# Altium schematic sheet Shels_System_Bmduino.SchDoc
size A4; SheetNumber: 1; SheetTotal: 1
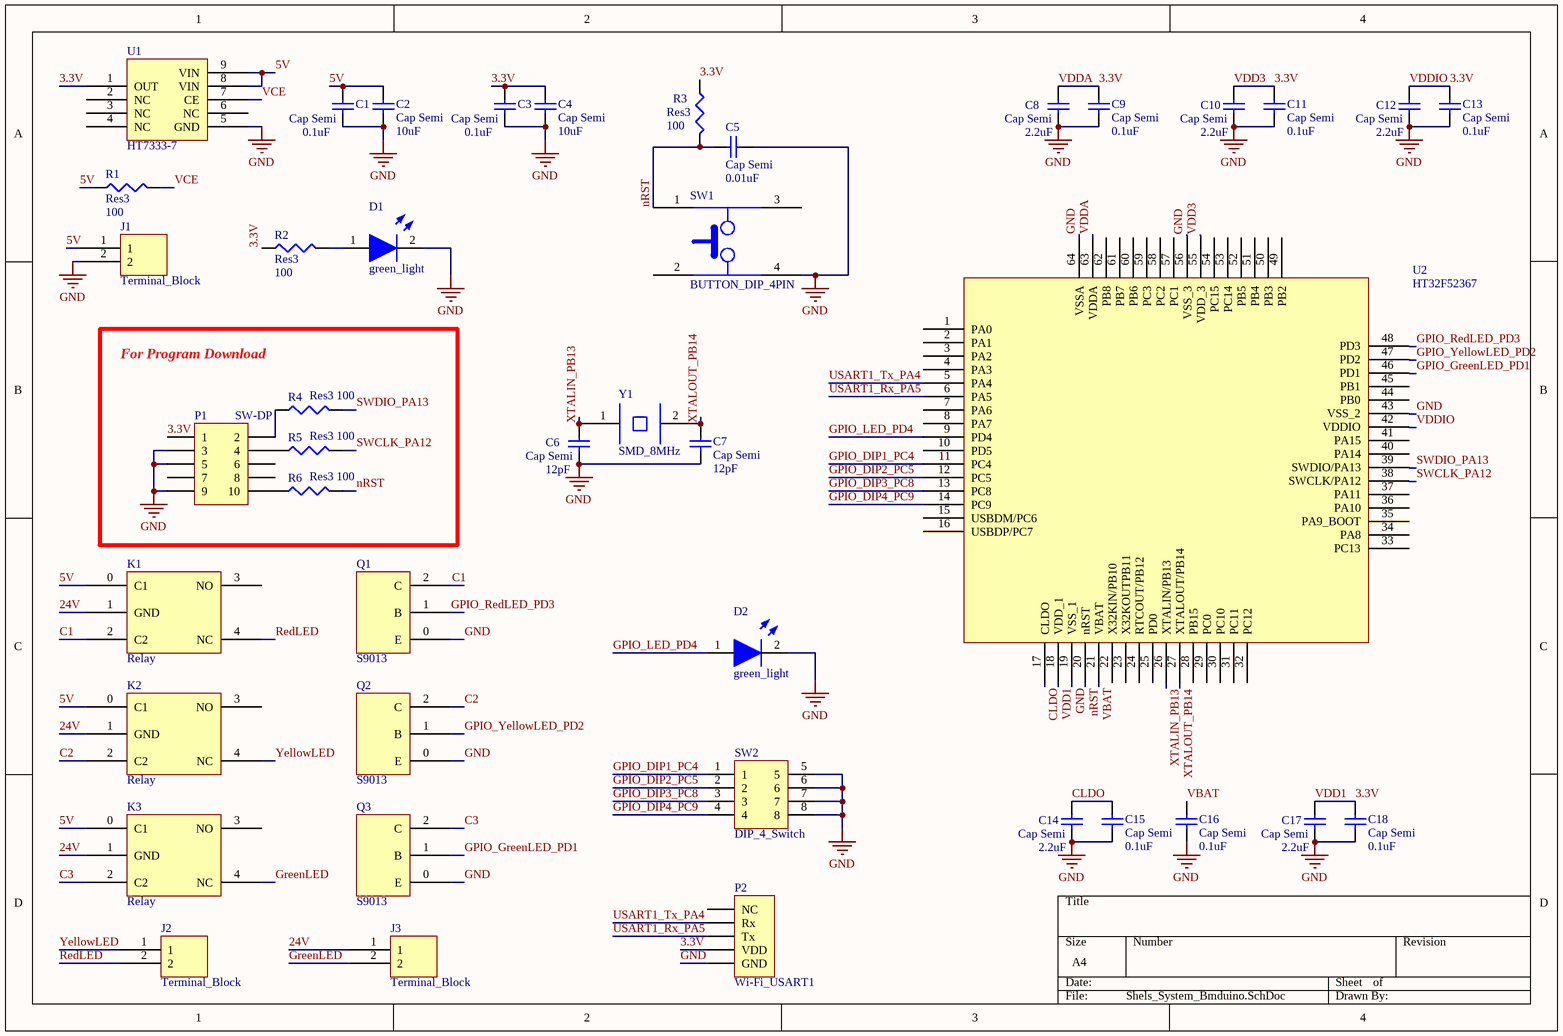
[diagram p0: Shels_System_Bmduino.SchDoc]

## Parts
C1  Cap Semi  value 0.1uF  [1608[0603]]
C2  Cap Semi  value 10uF  [1608[0603]]
C3  Cap Semi  value 0.1uF  [1608[0603]]
C4  Cap Semi  value 10uF  [1608[0603]]
C5  Cap Semi  value 0.01uF  [1608[0603]]
C6  Cap Semi  value 12pF  [1608[0603]]
C7  Cap Semi  value 12pF  [1608[0603]]
C8  Cap Semi  value 2.2uF  [1608[0603]]
C9  Cap Semi  value 0.1uF  [1608[0603]]
C10  Cap Semi  value 2.2uF  [1608[0603]]
C11  Cap Semi  value 0.1uF  [1608[0603]]
C12  Cap Semi  value 2.2uF  [1608[0603]]
C13  Cap Semi  value 0.1uF  [1608[0603]]
C14  Cap Semi  value 2.2uF  [1608[0603]]
C15  Cap Semi  value 0.1uF  [1608[0603]]
C16  Cap Semi  value 0.1uF  [1608[0603]]
C17  Cap Semi  value 2.2uF  [1608[0603]]
C18  Cap Semi  value 0.1uF  [1608[0603]]
D1  green_light  [LED_Green]
D2  green_light  [LED_Green]
J1  Terminal_Block  [terminal block]
J2  Terminal_Block  [terminal block]
J3  Terminal_Block  [terminal block]
K1  Relay  [Relay]
K2  Relay  [Relay]
K3  Relay  [Relay]
P1  SW-DP  [HDR2X5]
P2  Wi-Fi_USART1  [HDR1X5]
Q1  S9013  [S9013]
Q2  S9013  [S9013]
Q3  S9013  [S9013]
R1  Res3  value 100  [J1-0603]
R2  Res3  value 100  [J1-0603]
R3  Res3  value 100  [J1-0603]
R4  Res3  value 100  [J1-0603]
R5  Res3  value 100  [J1-0603]
R6  Res3  value 100  [J1-0603]
SW1  BUTTON_DIP_4PIN  [Push_Button]
SW2  DIP_4_Switch  [D_Switch_4]
U1  HT7333-7  [HT7333]
U2  HT32F52367  [HT32H52367]
Y1  SMD_8MHz  [Quartz-Crystal-8MHz]

## Blocks framed on the sheet
For Program Download: P1 R4-R6

## Nets
GND: C1.1 C2.1 C3.1 C4.1 C5.1 C6.2 C7.1 C8.2 C9.1 C10.2 C11.1 C12.2 C13.1 C14.2 C15.1 C16.1 C17.2 C18.1 D1.2 D2.2 J1.2 P1.3 P1.5 P1.9 P2.5(GND) Q1.0(E) Q2.0(E) Q3.0(E) SW1.4 SW2.5 SW2.6 SW2.7 SW2.8 U1.5(GND) U2.19(VSS_1) U2.43(VSS_2) U2.56(VSS_3) U2.64(VSSA)
3.3V: C3.2 C4.2 C8.1 C9.2 C10.1 C11.2 C12.1 C13.2 C17.1 C18.2 P1.1 P2.4(VDD) R2.1 R3.1 U1.1(OUT) U2.18(VDD_1) U2.42(VDDIO) U2.55(VDD_3) U2.63(VDDA)  [also labelled VDD1, VDD3, VDDA, VDDIO]
5V: C1.2 C2.2 J1.1 K1.0(C1) K2.0(C1) K3.0(C1) R1.1 U1.8(VIN) U1.9(VIN)
24V: J3.1 K1.1(GND) K2.1(GND) K3.1(GND)
C1: K1.2(C2) Q1.2(C)
C2: K2.2(C2) Q2.2(C)
C3: K3.2(C2) Q3.2(C)
CLDO: C14.1 C15.2 U2.17(CLDO)
GPIO_DIP1_PC4: SW2.1 U2.11(PC4)
GPIO_DIP2_PC5: SW2.2 U2.12(PC5)
GPIO_DIP3_PC8: SW2.3 U2.13(PC8)
GPIO_DIP4_PC9: SW2.4 U2.14(PC9)
GPIO_GreenLED_PD1: Q3.1(B) U2.46(PD1)
GPIO_LED_PD4: D2.1 U2.9(PD4)
GPIO_RedLED_PD3: Q1.1(B) U2.48(PD3)
GPIO_YellowLED_PD2: Q2.1(B) U2.47(PD2)
GreenLED: J3.2 K3.4(NC)
nRST: C5.2 R3.2 R6.2 SW1.1 U2.20(nRST)
RedLED: J2.2 K1.4(NC)
SWCLK_PA12: R5.2 U2.38(SWCLK/PA12)
SWDIO_PA13: R4.2 U2.39(SWDIO/PA13)
USART1_Rx_PA5: P2.3(Tx) U2.6(PA5)
USART1_Tx_PA4: P2.2(Rx) U2.5(PA4)
VBAT: C16.2 U2.21(VBAT)
VCE: R1.2 U1.7(CE)
XTALIN_PB13: C6.1 U2.26(XTALIN/PB13) Y1.1
XTALOUT_PB14: C7.2 U2.27(XTALOUT/PB14) Y1.2
YellowLED: J2.1 K2.4(NC)
NetD1_1: D1.1 R2.2
NetP1_2: P1.2 R4.1
NetP1_4: P1.4 R5.1
NetP1_10: P1.10 R6.1

Not connected (* = marked no-connect by the designer): K1 3(NO); K2 3(NO); K3 3(NO); P1 6 7 8; P2 1(NC); SW1 2 3; U1 2(NC) 3(NC) 4(NC) 6(NC); U2 1(PA0) 2(PA1) 3(PA2) 4(PA3) 7(PA6) 8(PA7) 10(PD5) 15(USBDM/PC6) 16(USBDP/PC7) 22(X32KIN/PB10) 23(X32KOUTPB11) 24(RTCOUT/PB12) 25(PD0) 28(PB15) 29(PC0) 30(PC10) 31(PC11) 32(PC12) 33(PC13) 34(PA8) 35(PA9_BOOT) 36(PA10) 37(PA11) 40(PA14) 41(PA15) 44(PB0) 45(PB1) 49(PB2) 50(PB3) 51(PB4) 52(PB5) 53(PC14) 54(PC15) 57(PC1) 58(PC2) 59(PC3) 60(PB6) 61(PB7) 62(PB8)

## Library data of the parts
C1-C18 = Cap Semi: Capacitor (Semiconductor SIM Model); Published: 8-Jun-2000; LatestRevisionDate: 29-May-2009; LatestRevisionNote: IPC-7351 Footprint Added.; PackageReference: C1206; Publisher: Altium Limited; PackageDescription: Chip Capacitor
D1 D2 = LED_Green
J1-J3 = Terminal Block
P1 = Header 5X2: Header, 5-Pin, Dual row; LatestRevisionDate: 17-Jul-2002; LatestRevisionNote: Re-released for DXP Platform.; Publisher: Altium Limited
P2 = Header 5: Header, 5-Pin; LatestRevisionDate: 17-Jul-2002; LatestRevisionNote: Re-released for DXP Platform.; Publisher: Altium Limited
R1-R6 = Res3: Resistor; Published: 8-Jun-2000; LatestRevisionDate: 29-May-2009; LatestRevisionNote: IPC-7351 Footprint Added.; PackageReference: J1-0603; Publisher: Altium Limited; PackageDescription: Chip Resistor
SW1 = Push_Button
SW2 = Switch_D_4
U1 = HT7333
Y1 = Quartz_Crystal_8MHz